# EAGLE design OpenLogicMicro (EAGLE 5.10)
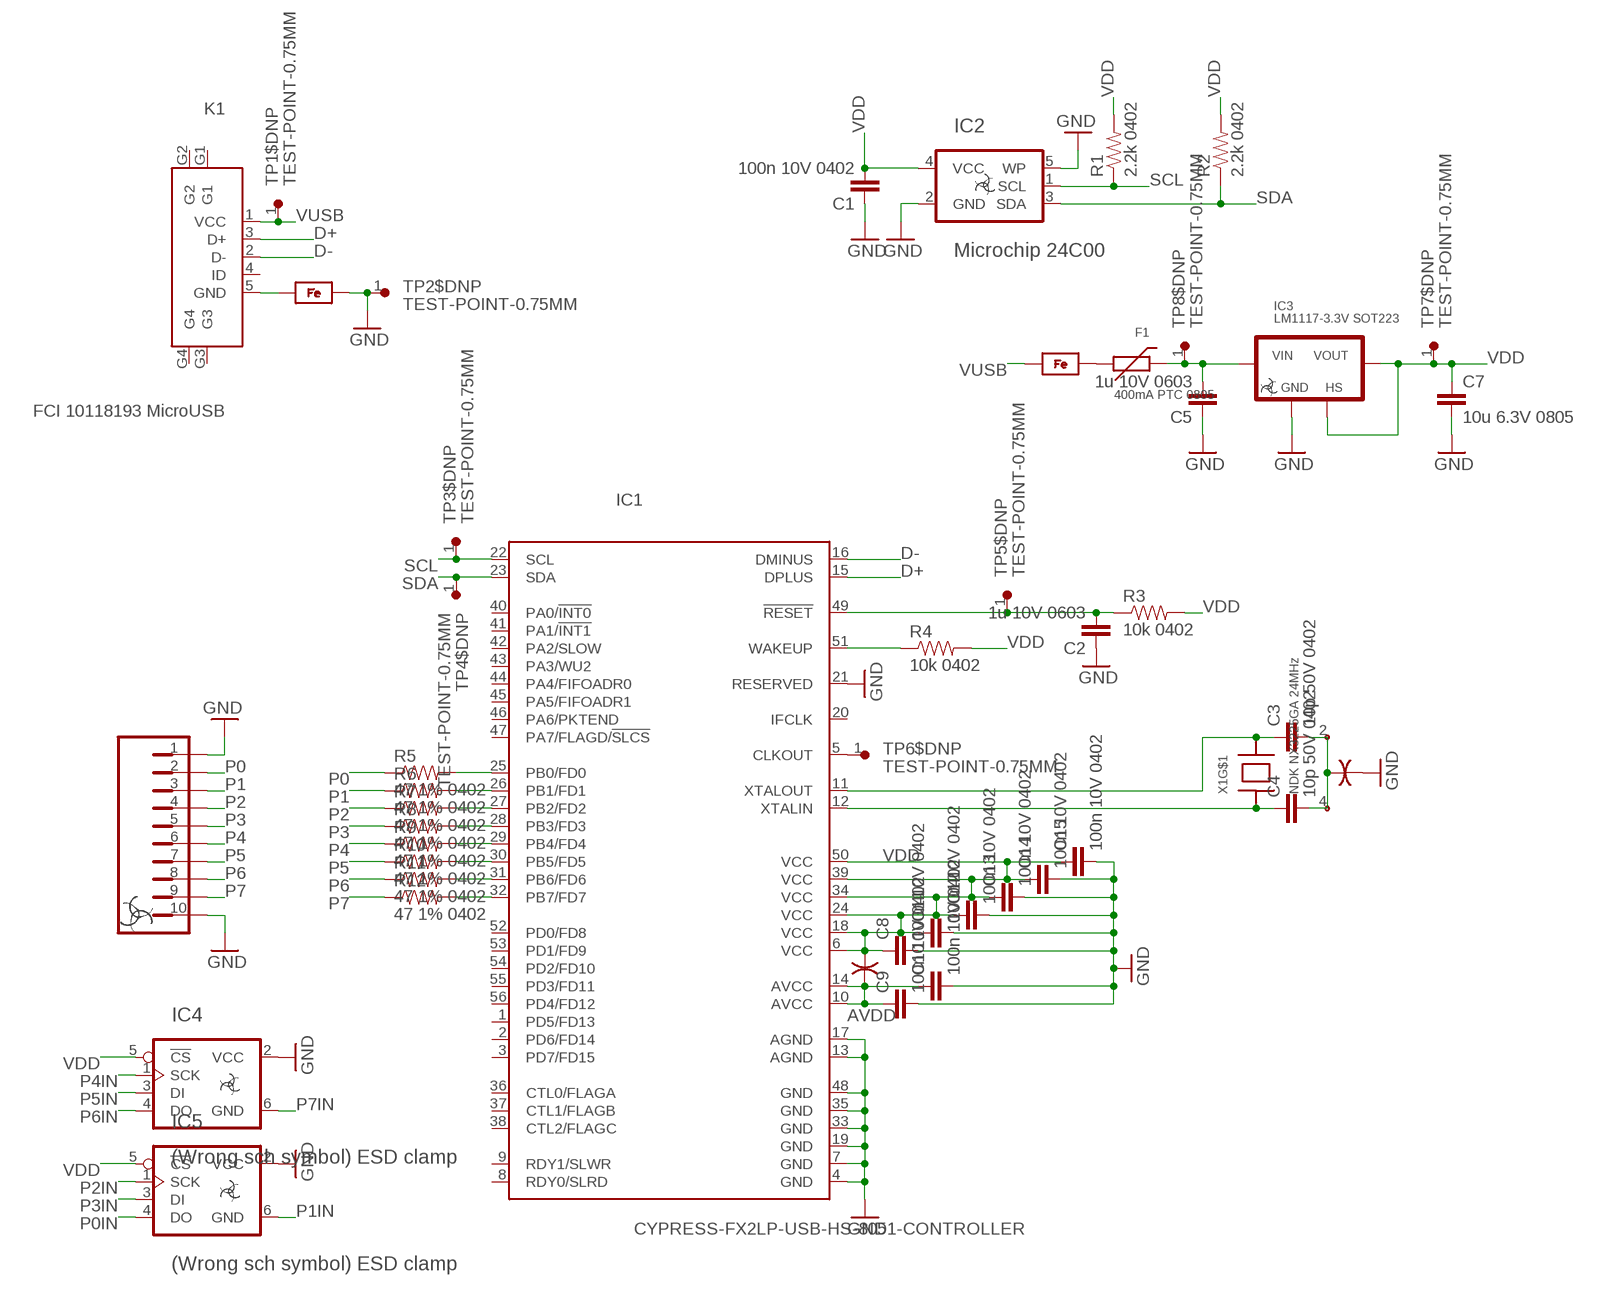
[diagram p0: schematic, sheet 1]

## Parts
C1  100n 10V 0402  CAP-0402-MIN  [0402-MIN]
C2  1u 10V 0603  CAP-0603-MIN  [0603-MIN]
C3  10p 50V 0402  CAP-0402-MIN  [0402-MIN]
C4  10p 50V 0402  CAP-0402-MIN  [0402-MIN]
C5  1u 10V 0603  CAP-0603-MIN  [0603-MIN]
C7  10u 6.3V 0805  CAP-0805-WIDE  [0805-WIDE]
C8  100n 10V 0402  CAP-0402-MIN  [0402-MIN]
C9  100n 10V 0402  CAP-0402-MIN  [0402-MIN]
C10  100n 10V 0402  CAP-0402-MIN  [0402-MIN]
C11  100n 10V 0402  CAP-0402-MIN  [0402-MIN]
C12  100n 10V 0402  CAP-0402-MIN  [0402-MIN]
C13  100n 10V 0402  CAP-0402-MIN  [0402-MIN]
C14  100n 10V 0402  CAP-0402-MIN  [0402-MIN]
C15  100n 10V 0402  CAP-0402-MIN  [0402-MIN]
F1  400mA PTC 0805  PTC-0805-EXTRAWIDE  [0805-EXTRAWIDE]
IC1  CYPRESS-FX2LP-USB-HS-8051-CONTROLLER  [TSSOP56]
IC2  Microchip 24C00  EEPROM-I2C-MCP-24AAXX/24LCXX  [SOT23-5]
IC3  LM1117-3.3V SOT223  LDO-REGULATOR-FIXED-NCP1117-HS=VOUT  [SOT223-3]
IC4  (Wrong sch symbol) ESD clamp  EEPROM-SPI-25CXX-MCP-25AA/LCXX-SOT23-6  [SOT23-6]
IC5  (Wrong sch symbol) ESD clamp  EEPROM-SPI-25CXX-MCP-25AA/LCXX-SOT23-6  [SOT23-6]
K1  FCI 10118193 MicroUSB  USB-5-PIN-MICROB-FCI-10118193-NARROW  [USB-MICROB-FCI-10118193-NARROW]
K2$DNP  HEADER-1X10-NO-SILK  [HEADER-1X10-NO-SILK-CHUNKY]
L1  3A 100R@100MHz Ferrite 0603  FERRITE-BEAD-0603-MIN  [0603-MIN]
L2  3A 100R@100MHz Ferrite 0603  FERRITE-BEAD-0603-MIN  [0603-MIN]
R1  2.2k 0402  RESISTOR-0402-MIN  [0402-MIN]
R2  2.2k 0402  RESISTOR-0402-MIN  [0402-MIN]
R3  10k 0402  RESISTOR-0402-MIN  [0402-MIN]
R4  10k 0402  RESISTOR-0402-MIN  [0402-MIN]
R5  47 1% 0402  RESISTOR-0402-MIN  [0402-MIN]
R6  47 1% 0402  RESISTOR-0402-MIN  [0402-MIN]
R7  47 1% 0402  RESISTOR-0402-MIN  [0402-MIN]
R8  47 1% 0402  RESISTOR-0402-MIN  [0402-MIN]
R9  47 1% 0402  RESISTOR-0402-MIN  [0402-MIN]
R10  47 1% 0402  RESISTOR-0402-MIN  [0402-MIN]
R11  47 1% 0402  RESISTOR-0402-MIN  [0402-MIN]
R12  47 1% 0402  RESISTOR-0402-MIN  [0402-MIN]
TP1$DNP  TEST-POINT-0.75MM  [TEST-POINT-0.75MM]
TP2$DNP  TEST-POINT-0.75MM  [TEST-POINT-0.75MM]
TP3$DNP  TEST-POINT-0.75MM  [TEST-POINT-0.75MM]
TP4$DNP  TEST-POINT-0.75MM  [TEST-POINT-0.75MM]
TP5$DNP  TEST-POINT-0.75MM  [TEST-POINT-0.75MM]
TP6$DNP  TEST-POINT-0.75MM  [TEST-POINT-0.75MM]
TP7$DNP  TEST-POINT-0.75MM  [TEST-POINT-0.75MM]
TP8$DNP  TEST-POINT-0.75MM  [TEST-POINT-0.75MM]
U1  GND-ISOLATOR-0.008"  [GND-ISOLATOR-0.008"]
U2  GND-ISOLATOR-0.008"  [GND-ISOLATOR-0.008"]
X1  NDK NX3225GA 24MHz  CRYSTAL-4-PIN-NDK-NX3225GA  [CRYSTAL-NDK-NX3225GA-3X2.5MM]

## Nets
!RESET: C2.1 IC1.49(!RESET) R3.1 TP5$DNP.1
AVDD: C9.2 C10.2 IC1.10(AVCC) IC1.14(AVCC) U2.1(A)
D+: IC1.15(DPLUS) K1.3(D+)
D-: IC1.16(DMINUS) K1.2(D-)
GND: C1.2 C2.2 C5.2 C7.1 C8.1 C9.1 C10.1 C11.1 C12.1 C13.1 C14.1 C15.1 IC1.4(GND) IC1.7(GND) IC1.13(AGND) IC1.17(AGND) IC1.19(GND) IC1.21(RESERVED) IC1.33(GND) IC1.35(GND) IC1.48(GND) IC2.2(GND) IC2.5(WP) IC3.1(GND) IC4.2(VCC) IC5.2(VCC) K2$DNP.1 K2$DNP.10 L2.2 TP2$DNP.1 U1.2(B)
N$1: C4.2 IC1.12(XTALIN) X1.1
N$2: C3.2 IC1.11(XTALOUT) X1.3
N$3: C3.1 C4.1 U1.1(A) X1.2 X1.4
N$5: IC1.51(WAKEUP) R4.1
N$6: IC1.5(CLKOUT) TP6$DNP.1
N$10: F1.1 L1.2
N$12: K1.5(GND) L2.1
P0: K2$DNP.2 R5.1
P0IN: IC1.25(PB0/FD0) IC5.4(DO) R5.2
P1: K2$DNP.3 R6.1
P1IN: IC1.26(PB1/FD1) IC5.6(GND) R6.2
P2: K2$DNP.4 R7.1
P2IN: IC1.27(PB2/FD2) IC5.1(SCK) R7.2
P3: K2$DNP.5 R8.1
P3IN: IC1.28(PB3/FD3) IC5.3(DI) R8.2
P4: K2$DNP.6 R9.1
P4IN: IC1.29(PB4/FD4) IC4.1(SCK) R9.2
P5: K2$DNP.7 R10.1
P5IN: IC1.30(PB5/FD5) IC4.3(DI) R10.2
P6: K2$DNP.8 R11.1
P6IN: IC1.31(PB6/FD6) IC4.4(DO) R11.2
P7: K2$DNP.9 R12.1
P7IN: IC1.32(PB7/FD7) IC4.6(GND) R12.2
SCL: IC1.22(SCL) IC2.1(SCL) R1.1 TP3$DNP.1
SDA: IC1.23(SDA) IC2.3(SDA) R2.1 TP4$DNP.1
VDD: C1.1 C7.2 C8.2 C11.2 C12.2 C13.2 C14.2 C15.2 IC1.6(VCC) IC1.18(VCC) IC1.24(VCC) IC1.34(VCC) IC1.39(VCC) IC1.50(VCC) IC2.4(VCC) IC3.2(VOUT) IC3.HEATSINK(HS) IC4.5(!CS) IC5.5(!CS) R1.2 R2.2 R3.2 R4.2 TP7$DNP.1 U2.2(B)
VUSB: K1.1(VCC) L1.1 TP1$DNP.1
VUSB_FILT: C5.1 F1.2 IC3.3(VIN) TP8$DNP.1
Unconnected: IC1.1(PD5/FD13) IC1.2(PD6/FD14) IC1.3(PD7/FD15) IC1.8(RDY0/SLRD) IC1.9(RDY1/SLWR) IC1.20(IFCLK) IC1.36(CTL0/FLAGA) IC1.37(CTL1/FLAGB) IC1.38(CTL2/FLAGC) IC1.40(PA0/!INT0) IC1.41(PA1/!INT1) IC1.42(PA2/SLOW) IC1.43(PA3/WU2) IC1.44(PA4/FIFOADR0) IC1.45(PA5/FIFOADR1) IC1.46(PA6/PKTEND) IC1.47(PA7/FLAGD/!SLCS) IC1.52(PD0/FD8) IC1.53(PD1/FD9) IC1.54(PD2/FD10) IC1.55(PD3/FD11) IC1.56(PD4/FD12) K1.4(ID) K1.G1 K1.G2 K1.G3 K1.G4

## Library data of the parts
C1-C5 C7-C15 = Outbreak:CAP
F1 = Outbreak:PTC
IC1 = Outbreak:CYPRESS-FX2LP-USB-HS-8051-CONTROLLER
IC2 = Outbreak:EEPROM-I2C
IC3 = Outbreak:LDO-REGULATOR-FIXED
IC4 IC5 = Outbreak:EEPROM-SPI-25CXX
K1 = Outbreak:USB-5-PIN
K2$DNP = Outbreak:HEADER-1X10-NO-SILK
L1 L2 = Outbreak:FERRITE-BEAD
R1-R12 = Outbreak:RESISTOR: Resistor Basic schematic elements and footprints for 0603, 1206, and PTH resistors.
TP1$DNP TP2$DNP TP3$DNP TP4$DNP TP5$DNP TP6$DNP TP7$DNP TP8$DNP = Outbreak:TEST-POINT
U1 U2 = Outbreak:GND-ISOLATOR
X1 = Outbreak:CRYSTAL-4-PIN

## Board
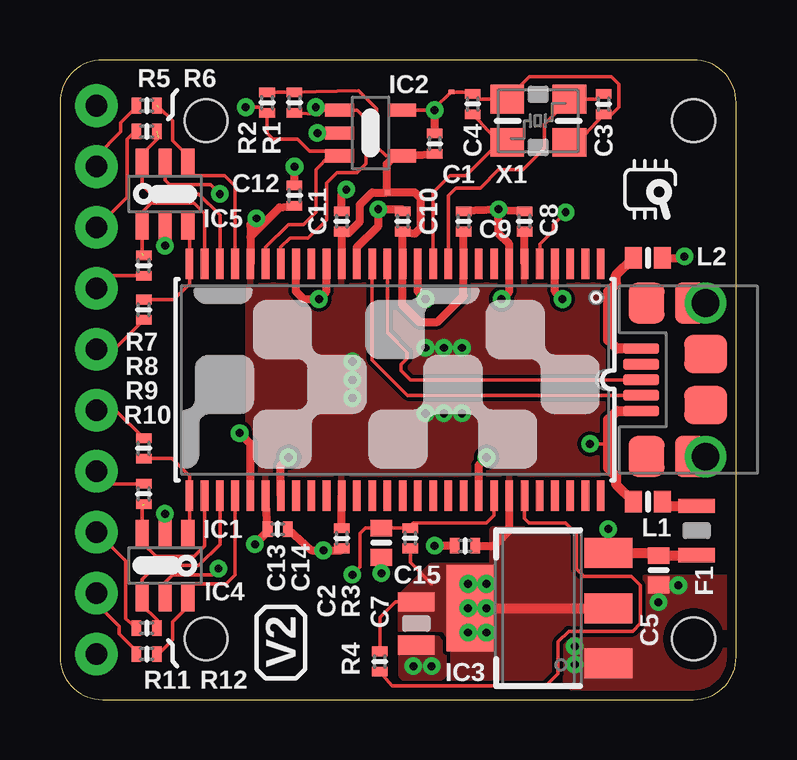
[diagram p1: board, top side]
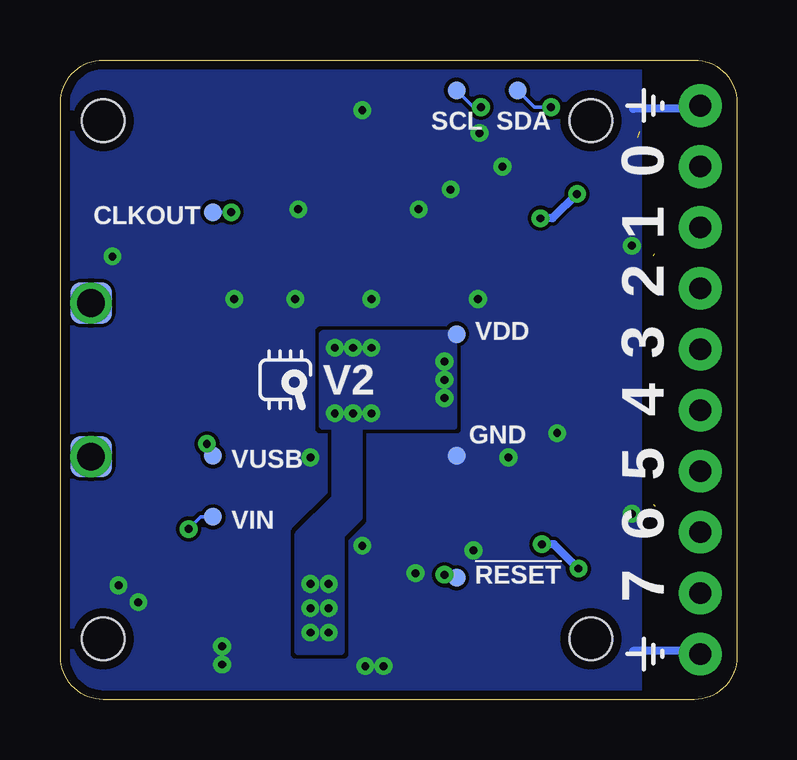
[diagram p2: board, bottom side, seen from below]

Size 28.19 x 26.67 mm. Coordinates in mm from the lower left corner, seen from the top.
Outline: 0,1.78 arc90 1.78,0 26.42,0 arc90 28.19,1.78 28.19,24.89 arc90 26.42,26.67 1.78,26.67 arc90 0,24.89 0,1.78
Copper layers (1*16): Top 0.035mm / dielectric 1.5mm / Bottom 0.035mm
Design rules "default *": minimum track width 6mil, minimum drill 13mil, track to track 6mil, track to pad 6mil, pad to pad 6mil, via to via 6mil, smd to smd 6mil, copper to edge 15mil, drill to drill 8mil, minimum pad ring 10mil, minimum via ring 8mil, stop-mask expansion 4mil, vias tented up to drill 20mil, thermal gap 10mil
Holes 1.78 mm at 26.42,2.54 6.1,24.13 6.1,2.54 26.42,24.13

### Footprints (pad centres in the part's own frame; a part is rotated, then mirrored left to right if it is on the bottom)
0402-MIN = smd 0.4 x 0.65: 1 -0.425,0; 2 0.425,0
0603-MIN = smd 0.7 x 0.9: 1 -0.61,0; 2 0.61,0
0805-WIDE = smd 0.8 x 1.524: 1 -0.9,0; 2 0.9,0
0805-EXTRAWIDE = smd 0.6 x 1.524: 1 -1.027,0; 2 1.027,0
TSSOP56 = smd 1.27 x 0.317: 1 -4.826,8.572; 2 -4.826,7.938; 3 -4.826,7.303; 4 -4.826,6.668; 5 -4.826,6.032; 6 -4.826,5.397; 7 -4.826,4.763; 8 -4.826,4.128; 9 -4.826,3.493; 10 -4.826,2.857; 11 -4.826,2.223; 12 -4.826,1.587; 13 -4.826,0.953; 14 -4.826,0.318; 15 -4.826,-0.318; 16 -4.826,-0.953; 17 -4.826,-1.587; 18 -4.826,-2.223; 19 -4.826,-2.857; 20 -4.826,-3.493; 21 -4.826,-4.128; 22 -4.826,-4.763; 23 -4.826,-5.397; 24 -4.826,-6.032; 25 -4.826,-6.668; 26 -4.826,-7.303; 27 -4.826,-7.938; 28 -4.826,-8.572; 29 4.826,-8.572; 30 4.826,-7.938; 31 4.826,-7.303; 32 4.826,-6.668; 33 4.826,-6.032; 34 4.826,-5.397; 35 4.826,-4.763; 36 4.826,-4.128; 37 4.826,-3.493; 38 4.826,-2.857; 39 4.826,-2.223; 40 4.826,-1.587; 41 4.826,-0.953; 42 4.826,-0.318; 43 4.826,0.318; 44 4.826,0.953; 45 4.826,1.587; 46 4.826,2.223; 47 4.826,2.857; 48 4.826,3.493; 49 4.826,4.128; 50 4.826,4.763; 51 4.826,5.397; 52 4.826,6.032; 53 4.826,6.668; 54 4.826,7.303; 55 4.826,7.938; 56 4.826,8.572
SOT23-5 = smd 0.55 x 1.2: 1 0.95,1.3; 2 0,1.3; 3 -0.95,1.3; 4 -0.95,-1.3; 5 0.95,-1.3
SOT223-3 = smd 1.25 x 2: 1 -2.3,-2.922; 2 0,-2.922; 3 2.3,-2.922 | smd 3.6 x 2: HEATSINK 0,2.825
SOT23-6 = smd 0.55 x 1.2: 1 0.95,1.3; 2 0,1.3; 3 -0.95,1.3; 4 -0.95,-1.3; 5 0,-1.3; 6 0.95,-1.3
USB-MICROB-FCI-10118193-NARROW = smd 0.44 x 1.5: 1 -1.3,2.7; 2 -0.65,2.7; 3 0,2.7; 4 0.65,2.7; 5 1.3,2.7 | smd 1.7 x 1.5: G1 -3.2,2.473; G4 3.2,2.473 | smd 1.6 x 1.8: G2 -1.055,0; G3 1.075,0 | smd 1.72 x 1.72 bottom: G5 -3.2,0; G7 3.2,0 | smd 1.72 x 1.3: G6 -3.2,0.635; G8 3.2,0.635 | drill 1.15 pad 1.7 round: P$1 -3.2,0; P$2 3.2,0
HEADER-1X10-NO-SILK-CHUNKY = drill 0.9 pad 1.778 round: 1 -11.43,0; 2 -8.89,0; 3 -6.35,0; 4 -3.81,0; 5 -1.27,0; 6 1.27,0; 7 3.81,0; 8 6.35,0; 9 8.89,0; 10 11.43,0
TEST-POINT-0.75MM = smd 0.75 x 0.75: 1 0,0
GND-ISOLATOR-0.008" = smd 0.203 x 0.203: 1 -0.025,0; 2 0.025,0
CRYSTAL-NDK-NX3225GA-3X2.5MM = smd 1.4 x 1.2: 1 -1.3,-0.9; 2 1.3,-0.9; 3 1.3,0.9; 4 -1.3,0.9

### Placement (x,y rotation side)
C1  15.62,23.18 90 top
C2  13.4,6.54 270 top
C3  22.67,24.83 90 top
C4  17.21,24.83 270 top
C5  24.96,5.4 270 top
C7  14.86,3.17 90 top
C8  19.37,19.94 270 top
C9  16.83,19.94 270 top
C10  14.29,19.94 270 top
C11  11.75,19.94 270 top
C12  9.78,21.02 270 top
C13  9.08,7.11 180 top
C14  11.75,6.73 90 top
C15  16.89,6.41 0 top
F1  26.54,7.05 270 top
IC1  13.97,13.34 270 top
IC2  12.95,23.62 90 top
IC3  19.94,3.81 90 top
IC4  4.38,5.59 0 top
IC5  4.38,21.08 180 top
K1  26.92,13.34 90 top
K2$DNP  1.52,13.34 270 top
L1  24.51,8.26 0 top
L2  24.51,18.41 0 top
R1  9.78,24.89 90 top
R2  8.64,24.89 90 top
R3  14.61,6.73 270 top
R4  13.34,1.59 90 top
R5  3.62,24.77 0 top
R6  3.62,23.69 0 top
R7  3.49,18.1 90 top
R8  3.49,16.26 90 top
R9  3.49,10.48 270 top
R10  3.49,8.57 270 top
R11  3.62,2.98 0 top
R12  3.62,1.91 0 top
TP1$DNP  21.84,10.16 0 bottom
TP2$DNP  11.68,10.16 0 bottom
TP3$DNP  11.68,25.4 0 bottom
TP4$DNP  9.14,25.4 0 bottom
TP5$DNP  11.68,5.08 0 bottom
TP6$DNP  21.84,20.32 0 bottom
TP7$DNP  11.68,15.24 0 bottom
TP8$DNP  21.84,7.62 0 bottom
U1  16.32,25.34 180 top
U2  13.65,21.15 180 top
X1  19.94,24.13 0 top

### Tracks (layer width: path | path; a pad name or v marks a point on that pad's centre or on a via)
!RESET  (via drill 0.33)
  Top 0.152: IC1.49 18.1,7.68 17.78,7.37 14.74,7.37 R3.1 14.52,7.15 C2.1 12.74,7.15 12.51,6.92 12.51,5.52 v12.19,5.21
  Bottom 0.152: TP5$DNP.1 12.07,5.08 v12.19,5.21
AVDD
  Top 0.33: C9.2 IC1.10 16.83,16.83 15.75,15.75 14.99,15.75 14.29,16.45 IC1.14 C10.2 14.8,19.44 15.05,19.68 15.05,20.89 14.8,21.14 U2.1
D+
  Top 0.152: K1.3 14.61,13.34 14.22,13.72 14.22,13.97 14.48,14.22 14.48,14.48 13.65,15.3 IC1.15
D-
  Top 0.152: K1.2 14.49,12.69 13.02,14.16 IC1.16
GND  (via drill 0.33)
  Top 0.152: U1.2 15.62,24.66 v15.62,24.57 IC2.5 | IC4.2 v4.38,7.75 | IC5.2 v4.38,18.92
  Top 0.33: IC1.33 7.94,10.67 v7.49,11.11 | IC1.35 9.21,9.78 v9.53,10.1 | IC1.48 17.46,9.78 v17.78,10.1 | IC1.19 11.11,17.02 v10.79,16.7 10.16,16.7 9.84,17.02 IC1.21 | IC1.13 14.92,17.02 v15.24,16.7 | v18.41,16.7 18.73,17.02 IC1.7 18.73,18.99 18.29,19.43 v18.29,20.45 | IC1.4 20.64,17.02 v20.95,16.7 | IC1.17 12.38,18.86 13.27,19.75 v13.27,20.45 14.28,20.45 C10.1 | C9.1 v18.28,20.44 v18.29,20.45 | C8.1 v18.3,20.44 v18.29,20.45 | IC2.2 v10.73,23.62 | C13.1 10.49,6.22 v10.99,6.22 11.74,6.22 C14.1 | L2.2 25.97,18.41 v26.04,18.48 | C2.2 v13.4,5.27 | v15.62,24.57 C1.2 | C15.1 v15.62,6.41 | C11.1 11.75,21.08 v11.94,21.27 | C12.1 v9.78,22.23
  Bottom 0.33: K2$DNP.1 1.65,24.64 4.32,24.64 | K2$DNP.10 1.65,2.03 4.32,2.03
  other vias: 15.49,1.4 21.46,1.46 24.96,4.06 25.78,4.76 21.46,2.22 14.73,1.4
  pour Bottom (rank 2): 4.06,26.67 28.19,26.67 28.19,0 4.06,0
  pour Top (rank 2, no thermals): 24.38,5.08 24.38,3.05 24.13,2.79 21.59,2.79 21.08,2.29 21.08,0.76 21.84,0 28.19,0 28.19,5.08
  pour Top (no thermals): 14.22,2.54 14.22,1.02 14.48,0.76 15.75,0.76 16,1.02 16,2.29 15.75,2.54
N$1
  Top 0.152: IC1.12 15.56,21.16 15.58,21.16 16.26,21.84 16.92,21.84 18.31,23.23 | 18.31,23.23 X1.1 | 18.31,23.23 C4.2
N$2
  Top 0.152: IC1.11 16.19,21.02 16.51,21.34 17.53,21.34 18.29,22.1 19.3,22.1 20.19,22.99 20.19,23.98 X1.3 22.37,25.03 C3.2
N$3
  Top 0.152: X1.2 21.57,23.23 C3.1 22.93,24.33 23.3,24.7 23.3,25.65 22.99,25.97 19.58,25.97 X1.4 17.51,25.03 C4.1 17.2,25.34 U1.1
N$5
  Top 0.152: IC1.51 19.37,7.56 19.56,7.37 21.08,7.37 21.53,6.92 21.53,5.46 21.84,5.14 23.81,5.14 24.19,4.76 24.19,3.17 23.88,2.86 21.21,2.86 20.76,2.41 20.76,1.08 20.26,0.57 13.85,0.57 R4.1
N$6  (via drill 0.33)
  Top 0.152: IC1.5 20,18.99 20.57,19.56 20.57,19.81 v21.08,20.32
  Bottom 0.152: v21.08,20.32 TP6$DNP.1
N$10
  Top 0.406: L1.2 25.12,8.07 F1.1
N$12
  Top 0.406: K1.5 23.21,14.63 22.86,14.99 22.86,17.02 23.18,17.34 23.18,17.69 L2.1
P0
  Top 0.152: R5.1 3.12,24.65 3.11,24.64 2.54,24.06 2.54,23.69 1.52,22.67 K2$DNP.2
P0IN  (1 unrouted)
  Top 0.152: 4.12,24.71 4.7,24.13 4.7,23.3 5.33,22.67 IC5.4 5.27,22.1 5.53,21.84 6.86,21.84 7.3,21.4 IC1.25
P1
  Top 0.152: K2$DNP.3 2.79,20.95 2.79,23.36 3.12,23.69 R6.1
P1IN  (1 unrouted)
  Top 0.152: 4.12,23.42 3.43,22.73 IC5.6 3.43,21.46 3.81,21.08 5.78,21.08 6.67,20.19 IC1.26
P2
  Top 0.152: R7.1 2.05,17.67 K2$DNP.4
P2IN  (1 unrouted)
  Top 0.152: IC5.1 3.43,20.32 3.81,20.7 5.59,20.7 6.03,20.26 IC1.27 | IC5.1 | IC5.1 3.43,18.6
P3
  Top 0.152: K2$DNP.5 2.27,14.61 R8.1
P3IN
  Top 0.152: 5.4,19.78 IC5.3 5.4,19.72 IC1.28 5.4,17.34 4.74,16.68 R8.2
P4
  Top 0.152: K2$DNP.6 2.33,12.06 R9.1
P4IN
  Top 0.152: IC1.29 5.4,8.7 | IC1.29 5.4,9.34 4.68,10.05 R9.2 | 5.4,6.89 IC4.1 5.4,6.95 IC1.29
P5
  Top 0.152: R10.1 2.05,9 K2$DNP.7
P5IN  (1 unrouted)
  Top 0.152: 3.43,8.07 IC4.3 3.43,6.54 4,5.97 5.59,5.97 6.03,6.41 IC1.30
P6
  Top 0.152: R11.1 2.73,3.37 2.73,5.78 K2$DNP.8
P6IN
  Top 0.152: IC1.31 6.67,6.48 5.78,5.59 4,5.59 3.43,5.02 IC4.4 3.43,3.93 4.04,3.32 R11.2
P7
  Top 0.152: R12.1 3.12,2.1 2.48,2.74 2.48,3.05 1.52,4 K2$DNP.9
P7IN
  Top 0.152: IC1.32 7.3,5.21 6.92,4.83 5.59,4.83 5.27,4.51 IC4.6 5.33,3.87 4.7,3.24 4.7,2.48 4.12,1.91 R12.2
SCL  (via drill 0.33)
  Top 0.152: 10.98,24.57 IC2.1 12.38,24.57 12.76,24.19 12.76,22.35 12.38,21.97 11.56,21.97 11.11,21.53 11.11,20 10.35,19.24 9.59,19.24 9.21,18.86 IC1.22 | 10.98,24.57 10.8,24.39 R1.1 | v10.67,24.7 10.8,24.57 10.98,24.57
  Bottom 0.152: TP3$DNP.1 10.99,24.7 v10.67,24.7
SDA  (via drill 0.33)
  Top 0.152: IC1.23 8.57,18.86 9.53,19.81 10.16,19.81 10.67,20.32 10.67,22.1 11.24,22.67 | 11.24,22.67 IC2.3 | 11.24,22.67 11.05,22.86 10.41,22.86 9.91,23.37 8.89,23.37 8.64,23.62 R2.1 8.33,24.7 v7.75,24.7
  Bottom 0.152: TP4$DNP.1 8.45,24.7 v7.75,24.7
VDD  (via drill 0.33)
  Top 0.152: IC2.4 13.97,22.67 13.59,22.67 13.21,23.05 13.21,24.64 12.45,25.39 R1.2 R2.2 | R3.2 14.61,5.71 15.49,4.83 | R4.2 13.34,3.43 13.98,4.08 C7.2 | C13.2 8.58,7.1 | 9.15,20.52 9.53,20.53 | IC5.5 4.38,21.65 4.57,21.46 6.29,21.46 v6.67,21.08 | IC4.5 4.38,4.89 4.7,5.21 6.35,5.21 v6.6,5.46
  Top 0.305: C11.2 12.01,19.44
  Top 0.33: IC1.6 C8.2 | C11.2 IC1.18 | C14.2 IC1.39 | IC1.34 C13.2 8.58,6.93 v8.13,6.48 | 12.01,19.44 12.51,19.94 12.51,20.64 13.02,21.14 U2.2 13.63,22.33 13.97,22.67 | IC3.HEATSINK 17.52,3.81 | IC1.50 18.73,7.05 18.1,6.41 C15.2 | IC2.4 C1.1 | C12.2 9.15,20.52 8.38,19.75 | 7.94,19.3 IC1.24 | 7.94,19.3 8.38,19.75 | v8.19,20.07 7.94,19.81 7.94,19.75 | 7.94,19.75 7.94,19.3 | 7.94,19.75 8.38,19.75
  Top 0.406: IC3.HEATSINK IC3.2
  Bottom 0.33: v6.6,5.46 7.62,6.48 v8.13,6.48 | v6.67,21.08 7.68,20.07 v8.19,20.07
  other vias: 12.19,14.1 12.19,13.34 12.19,12.57 15.24,14.67 16,14.67 16.76,14.67 16.76,11.94 16,11.94 15.24,11.94 17.02,2.79 17.02,3.81 17.02,4.83 17.78,4.83 17.78,3.81 17.78,2.79
  pour Top: 7.87,17.78 22.61,17.78 22.61,8.89 7.87,8.89
  pour Bottom: 11.81,15.24 17.27,15.24 17.27,11.43 16.76,11.43 16.76,8.38 18.29,6.86 18.29,2.03 16.51,2.03 16.51,6.86 15.75,7.62 15.75,11.43 11.81,11.43
  pour Top (rank 3, no thermals): 14.22,1.02 14.22,4.32 15.49,5.59 18.03,5.59 18.03,7.11 21.59,7.11 21.59,0.51 14.73,0.51
VUSB  (via drill 0.33)
  Top 0.152: 22.86,9.65 22.86,10.67 v22.1,10.67
  Top 0.406: K1.1 23.21,12.04 22.86,11.68 22.86,9.65 23.18,9.34 23.18,8.98 L1.1
  Bottom 0.152: TP1$DNP.1 21.84,10.41 v22.1,10.67
VUSB_FILT  (via drill 0.33)
  Top 0.152: IC3.3 v22.86,7.11
  Top 0.406: F1.2 C5.1 24.95,6.11 IC3.3
  Bottom 0.152: TP8$DNP.1 22.35,7.62 v22.86,7.11

### Text on the board
tPlace: V2
bPlace: SCL | SDA | 0 | 1 | CLKOUT | 2 | 3 | VDD | 4 | V2 | 5 | GND | VUSB | 6 | VIN | 7 | !RESET
tTest: OpenLogic micro | Cypress CY7C68013A | Logic Analyzer